# Altium schematic sheet LEDs.SchDoc
size A; SheetNumber: 5; SheetTotal: 10
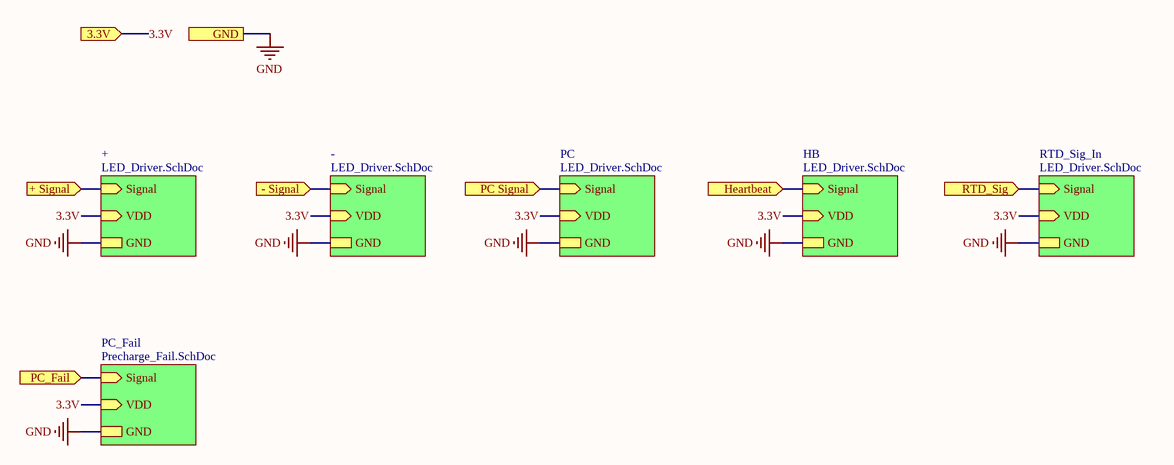
[diagram p0: LEDs.SchDoc]

## Sub-sheets
+ = LED_Driver.SchDoc: Signal (in), VDD (in), GND
- = LED_Driver.SchDoc: Signal (in), VDD (in), GND
HB = LED_Driver.SchDoc: Signal (in), VDD (in), GND
PC = LED_Driver.SchDoc: Signal (in), VDD (in), GND
PC_Fail = Precharge_Fail.SchDoc: Signal (in), VDD (in), GND
RTD_Sig_In = LED_Driver.SchDoc: Signal (in), VDD (in), GND

## Ports
3.3V (in), + Signal (in), - Signal (in), GND, Heartbeat (in), PC Signal (in), PC_Fail (in), RTD_Sig (in)

## Nets
GND: port GND, sheet +/GND, sheet -/GND, sheet PC/GND, sheet HB/GND, sheet RTD_Sig_In/GND, sheet PC_Fail/GND
3.3V: port 3.3V, sheet +/VDD, sheet -/VDD, sheet PC/VDD, sheet HB/VDD, sheet RTD_Sig_In/VDD, sheet PC_Fail/VDD
+ Signal: port + Signal, sheet +/Signal
- Signal: port - Signal, sheet -/Signal
Heartbeat: port Heartbeat, sheet HB/Signal
PC Signal: port PC Signal, sheet PC/Signal
PC_Fail: port PC_Fail, sheet PC_Fail/Signal
RTD_Sig: port RTD_Sig, sheet RTD_Sig_In/Signal